# Altium schematic sheet Frontend.SchDoc: CATS Telemetry
size A4; Author: Luca Jost; Revision: 1.0; SheetNumber: 6; SheetTotal: 7; Subtitle: Front End
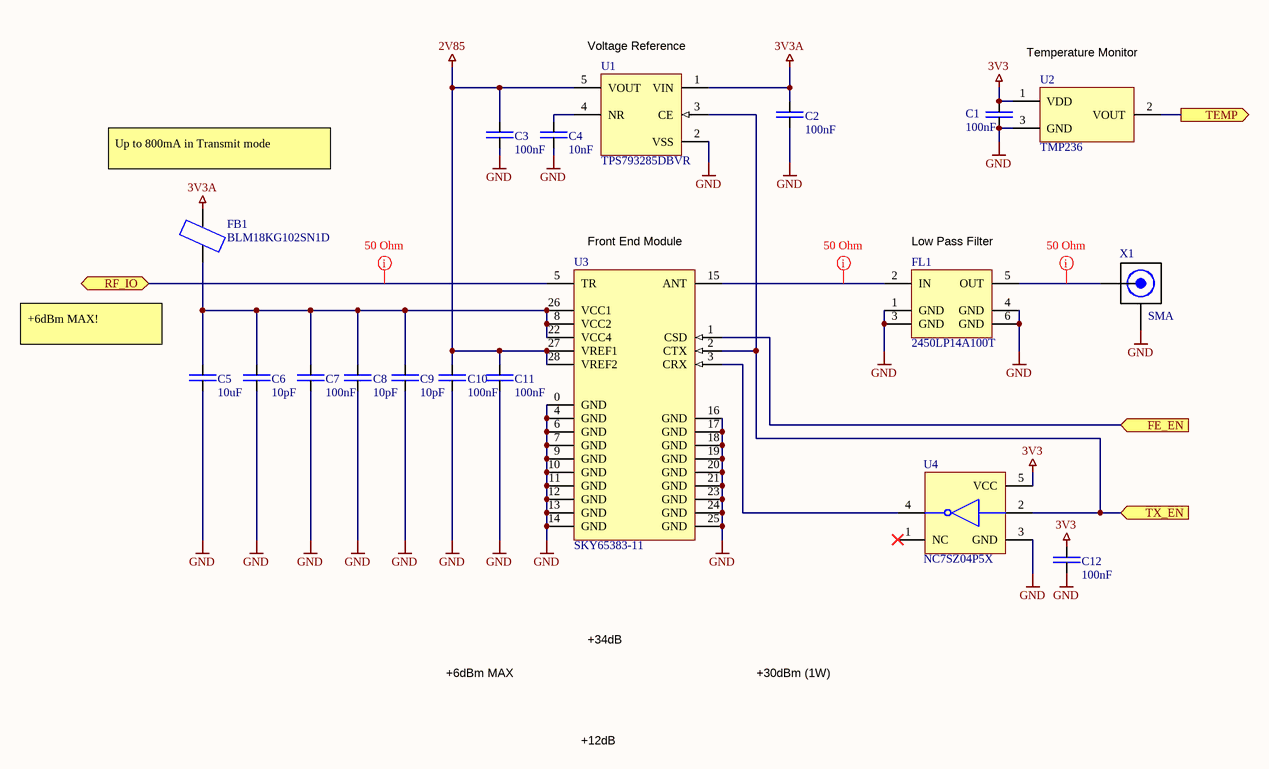
[diagram p0: Frontend.SchDoc]

## Parts
C1  100nF  [SMD Keramikkondensator 0603]
C2  100nF  [SMD Keramikkondensator 0603]
C3  100nF  [SMD Keramikkondensator 0603]
C4  10nF  [SMD Keramikkondensator 0603]
C5  10uF  [SMD Keramikkondensator 0603]
C6  10pF  [SMD Keramikkondensator 0603]
C7  100nF  [SMD Keramikkondensator 0603]
C8  10pF  [SMD Keramikkondensator 0603]
C9  10pF  [SMD Keramikkondensator 0603]
C10  100nF  [SMD Keramikkondensator 0603]
C11  100nF  [SMD Keramikkondensator 0603]
C12  100nF  [SMD Keramikkondensator 0603]
FB1  BLM18KG102SN1D  [SMD Ferrite Bead 0603]
FL1  2450LP14A100T  [SMD Filter 2450LP14A100T]
U1  TPS793285DBVR  [SMD IC SOT-23-5]
U2  TMP236  [SMD IC SOT-23]
U3  SKY65383-11  [SMD IC 28-MCM]
U4  NC7SZ04P5X  [SMD IC SOT-353 (SC-70-5)]
X1  SMA  [THT Buchse SMA Female]

## Ports
FE_EN (in), RF_IO (bidir), TEMP (out), TX_EN (in)

## Nets
2V85: C3.2 C10.2 C11.2 U1.5(VOUT) U3.27(VREF1) U3.28(VREF2)
3V3: C1.2 C12.2 U2.1(VDD) U4.5(VCC)
3V3A: C2.2 FB1.2 U1.1(VIN)
GND: C1.1 C2.1 C3.1 C4.1 C5.1 C6.1 C7.1 C8.1 C9.1 C10.1 C11.1 C12.1 FL1.1(GND) FL1.3(GND) FL1.4(GND) FL1.6(GND) U1.2(VSS) U2.3(GND) U3.0(GND) U3.4(GND) U3.6(GND) U3.7(GND) U3.9(GND) U3.10(GND) U3.11(GND) U3.12(GND) U3.13(GND) U3.14(GND) U3.16(GND) U3.17(GND) U3.18(GND) U3.19(GND) U3.20(GND) U3.21(GND) U3.23(GND) U3.24(GND) U3.25(GND) U4.3(GND) X1.2(RF)
FE_EN: U3.1(CSD) ; port FE_EN
RF_IO: U3.5(TR) ; port RF_IO
TEMP: U2.2(VOUT) ; port TEMP
TX_EN: U1.3(CE) U3.2(CTX) U4.2(A) ; port TX_EN
NetC4_2: C4.2 U1.4(NR)
NetC5_2: C5.2 C6.2 C7.2 C8.2 C9.2 FB1.1 U3.8(VCC2) U3.22(VCC4) U3.26(VCC1)
NetFL1_2: FL1.2(IN) U3.15(ANT)
NetFL1_5: FL1.5(OUT) X1.1(RF)
NetU3_3: U3.3(CRX) U4.4(Y)

Not connected (* = marked no-connect by the designer): U4 1(NC)*

## Layout directives
rule Impedance Constraint [Min = 50.00    Max = 50.00    ]; net class RF-Line 50: NetFL1_2, NetFL1_5, RF_IO

## Notes on the sheet
- (near U1) Voltage Reference
- Temperature Monitor
- Up to 800mA in Transmit mode
- (near U3) Front End Module
- (near FL1) Low Pass Filter
- +6dBm MAX!
- +6dBm MAX
- +34dB
- +30dBm (1W)
- +12dB
- Title
- Author:
- Subtitle
- Date:
- Rev:
- CATS
- Sheet
- of
- File:

## Library data of the parts
C1-C3 C7 C10-C12 = E6 - 100nF: SMD Ceramic Capacitor E6; Unit Price: 0.01; Number: -; Supplier: -
C4 = E6 - 10nF: SMD Ceramic Capacitor E6; Unit Price: 0.01; Number: -; Supplier: -
C5 = E6 - 10uF: SMD Ceramic Capacitor E6; Unit Price: 0.01; Number: -; Supplier: -
C6 C8 C9 = E6 - 10pF: SMD Ceramic Capacitor E6; Unit Price: 0.01; Number: -; Supplier: -
FB1 = BLM18KG102SN1D: 1 kOhms @ 100MHz 1 Power Line Ferrite Bead 0603 (1608 Metric) 1A 200mOhm; ComponentLink1Description: Datasheet; ComponentLink1URL: https://www.murata.com/en-us/products/productdata/8796738650142/ENFA0003.pdf; Digikey: 490-17349-1-ND
FL1 = 2450LP14A100T: 2.45GHz Center Frequency Low Pass RF Filter (Radio Frequency) 100MHz Bandwidth 0.5dB 0603 (1608 Metric), 6 PC Pad; ComponentLink1Description: Datasheet; ComponentLink1URL: https://www.johansontechnology.com/datasheets/2450LP14A100/2450LP14A100.pdf; Digikey: 712-1129-2-ND
U1 = TPS793285DBVR: Linear Voltage Regulator IC Positive Fixed 1 Output  200mA SOT-23-5 2.85V; ComponentLink1Description: Datasheet; ComponentLink1URL: https://media.digikey.com/pdf/Data%20Sheets/Texas%20Instruments%20PDFs/TPS793_Rev2015.pdf; Digikey: 296-12157-1-ND
U2 = TMP236: Low-Power, High-Accuracy Analog Output Temperature Sensors; ComponentLink1Description: Datasheet; ComponentLink1URL: https://www.ti.com/lit/ds/symlink/tmp236.pdf?HQS=dis-dk-null-digikeymode-dsf-pf-null-wwe&ts=1624574807670&ref_url=https%253A%252F%252Fwww.digikey.ch%252F; Digikey: 296-TMP236A4DBZRCT-ND
U3 = SKY65383-11: 2400 to 2483 MHz Transmit/Receive / Front-End Module +30dBm; ComponentLink1Description: Datasheet; ComponentLink1URL: https://www.skyworksinc.com/-/media/SkyWorks/Documents/Products/2901-3000/SKY65383-11_202668G.pdf; Digikey: 863-1798-1-ND
U4 = NC7SZ04P5X: Inverter IC 1 Channel  SC-70-5; ComponentLink1Description: Datasheet; ComponentLink1URL: https://rocelec.widen.net/view/pdf/vg5irfcitj/ONSM-S-A0003590433-1.pdf?t.download=true&u=5oefqw
X1 = SMA Connector: Female SMA Connector THT; Digikey: 931-1361-ND